# Altium project Distance-Sensor-Board.PrjPcb
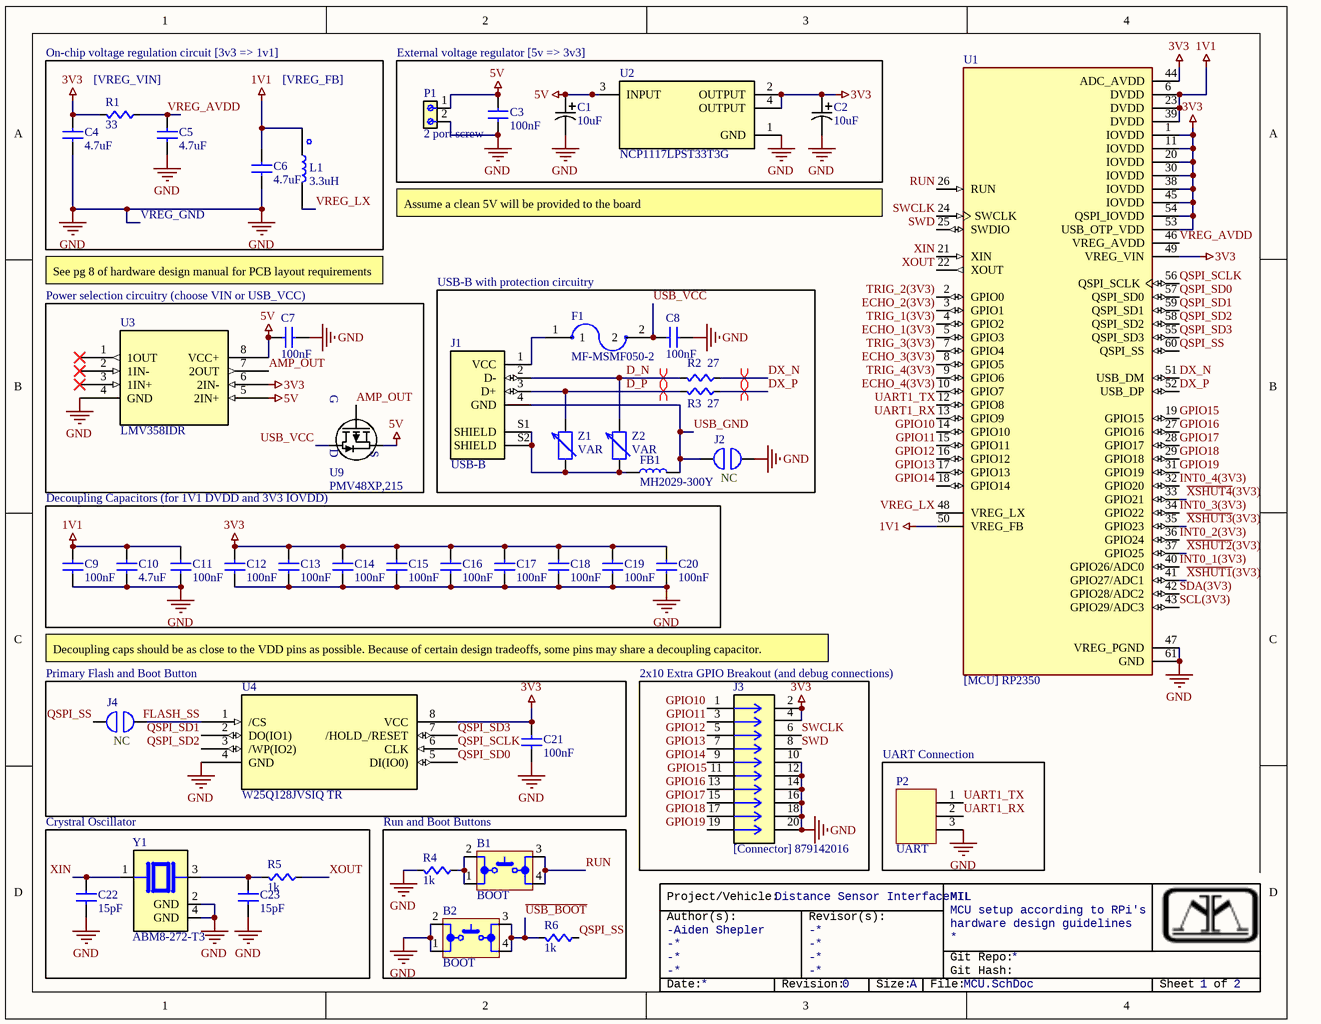
[diagram p0: MCU.SchDoc]
1 sheet, 48 parts. Net scope: global (net labels, ports and power ports of the same name join across sheets).
Board file: main.PcbDoc

## Sheet MCU.SchDoc
size A; Organization: MIL; Address1: MCU setup according to RPi's; Address2: hardware design guidelines; Revision: 0; SheetNumber: 1; SheetTotal: 2; Project: Distance Sensor Interface; Author1: Aiden Shepler

### Parts
B1  BOOT  [SPST-PUSH-BUTTON]
B2  BOOT  [SPST-PUSH-BUTTON]
C1  10uF  [RADIAL_CAN_CAP_4_X_5.8_SMD]
C2  10uF  [RADIAL_CAN_CAP_4_X_5.8_SMD]
C3  value 100nF  [CAPC0603]  (hidden comment: Cap)
C4  value 4.7uF  [CAPC0603]  (hidden comment: Cap)
C5  value 4.7uF  [CAPC0603]  (hidden comment: Cap)
C6  value 4.7uF  [CAPC0603]  (hidden comment: Cap)
C7  value 100nF  [CAPC0603]  (hidden comment: Cap)
C8  value 100nF  [CAPC0603]  (hidden comment: Cap)
C9  value 100nF  [CAPC0603]  (hidden comment: Cap)
C10  value 4.7uF  [CAPC0603]  (hidden comment: Cap)
C11  value 100nF  [CAPC0603]  (hidden comment: Cap)
C12  value 100nF  [CAPC0603]  (hidden comment: Cap)
C13  value 100nF  [CAPC0603]  (hidden comment: Cap)
C14  value 100nF  [CAPC0603]  (hidden comment: Cap)
C15  value 100nF  [CAPC0603]  (hidden comment: Cap)
C16  value 100nF  [CAPC0603]  (hidden comment: Cap)
C17  value 100nF  [CAPC0603]  (hidden comment: Cap)
C18  value 100nF  [CAPC0603]  (hidden comment: Cap)
C19  value 100nF  [CAPC0603]  (hidden comment: Cap)
C20  value 100nF  [CAPC0603]  (hidden comment: Cap)
C21  value 100nF  [CAPC0603]  (hidden comment: Cap)
C22  value 15pF  [CAPC0603]  (hidden comment: Cap)
C23  value 15pF  [CAPC0603]  (hidden comment: Cap)
F1  MF-MSMF050-2  [FUSM4632X85]
FB1  MH2029-300Y  [L0805]
J1  USB-B  [SAMTEC_USB-B-S-X-X-TH]
J2  NO/NC: NC  [[Jumper] Solderable Jumper]  (hidden comment: Thru-Hole Jumper)
J3  [Connector] 879142016  [[Connector] CONN20]
J4  NO/NC: NC  [[Jumper] Solderable Jumper]  (hidden comment: Thru-Hole Jumper)
L1  3.3uH  [2016_SMD_Inductor]
P1  2 port screw  [[CONNECTOR] 5MM_2PORT_SCREW]
P2  UART  [MOLEX-HDR-1X3-SHERLOCK-RA]
R1  value 33  [RES0603]  (hidden comment: Res)
R2  value 27  [RES0603]  (hidden comment: Res)
R3  value 27  [RES0603]  (hidden comment: Res)
R4  value 1k  [RES0603]  (hidden comment: Res)
R5  value 1k  [RES0603]  (hidden comment: Res)
R6  value 1k  [RES0603]  (hidden comment: Res)
U1  [MCU] RP2350  [QFN40P700X700X90-61N]
U2  NCP1117LPST33T3G  [SOT230P700X175-4N]
U3  LMV358IDR  [SOIC-8]
U4  W25Q128JVSIQ TR  [SOIC_208MIL_WIN]
U9  PMV48XP,215  [SOT23_NEX]
Y1  ABM8-272-T3  [XTAL_ABM8-272-T3]
Z1  VAR  [VARC1608X56N]
Z2  VAR  [VARC1608X56N]

### Blocks framed on the sheet
External voltage regulator [5v => 3v3]: C1-C3 P1 U2
USB-B with protection circuitry: C8 F1 FB1 J1 J2 R2 R3 Z1 Z2
Power selection circuitry (choose VIN or USB_VCC): C7 U3 U9
Decoupling Capacitors (for 1V1 DVDD and 3V3 IOVDD): C9-C20
Primary Flash and Boot Button: C21 J4 U4
2x10 Extra GPIO Breakout (and debug connections): J3
UART Connection: P2
Crystral Oscillator: C22 C23 R5 Y1
Run and Boot Buttons: B1 B2 R4 R6

### Nets
1V1: C6.1(A) C9.1(A) C10.1(A) C11.1(A) L1.1 U1.6(DVDD) U1.23(DVDD) U1.39(DVDD) U1.50(VREG_FB)
3V3: C2.1 C4.1(A) C12.1(A) C13.1(A) C14.1(A) C15.1(A) C16.1(A) C17.1(A) C18.1(A) C19.1(A) C20.1(A) C21.1(A) J3.2 J3.4 R1.1(A) U1.1(IOVDD) U1.11(IOVDD) U1.20(IOVDD) U1.30(IOVDD) U1.38(IOVDD) U1.44(ADC_AVDD) U1.45(IOVDD) U1.49(VREG_VIN) U1.53(USB_OTP_VDD) U1.54(QSPI_IOVDD) U2.2(OUTPUT) U2.4(OUTPUT) U3.6(2IN-) U4.8(VCC)
5V: C1.1 C3.1(A) C7.1(A) P1.1 U2.3(INPUT) U3.5(2IN+) U3.8(VCC+) U9.2(S)
GND: B2.1 B2.2 C1.2 C2.2 C3.2(B) C4.2(B) C5.2(B) C6.2(B) C7.2(B) C8.1(A) C9.2(B) C10.2(B) C11.2(B) C12.2(B) C13.2(B) C14.2(B) C15.2(B) C16.2(B) C17.2(B) C18.2(B) C19.2(B) C20.2(B) C21.2(B) C22.2(B) C23.2(B) J2.2 J3.10 J3.12 J3.14 J3.16 J3.18 J3.20 P1.2 P2.3 R4.1(A) U1.47(VREG_PGND) U1.61(GND) U2.1(GND) U3.4(GND) U4.4(GND) Y1.2(GND) Y1.4(GND)
AMP_OUT: U3.7(2OUT) U9.1(G)
D_N: J1.2(D-) R2.1(A) Z2.2
D_P: J1.3(D+) R3.1(A) Z1.2
DX_N: R2.2(B) U1.51(USB_DM)
DX_P: R3.2(B) U1.52(USB_DP)
ECHO_1(3V3): U1.5(GPIO3)
ECHO_2(3V3): U1.3(GPIO1)
ECHO_3(3V3): U1.8(GPIO5)
ECHO_4(3V3): U1.10(GPIO7)
FLASH_SS: J4.2 U4.1(/CS)
GPIO10: J3.1 U1.14(GPIO10)
GPIO11: J3.3 U1.15(GPIO11)
GPIO12: J3.5 U1.16(GPIO12)
GPIO13: J3.7 U1.17(GPIO13)
GPIO14: J3.9 U1.18(GPIO14)
GPIO15: J3.11 U1.19(GPIO15)
GPIO16: J3.13 U1.27(GPIO16)
GPIO17: J3.15 U1.28(GPIO17)
GPIO18: J3.17 U1.29(GPIO18)
GPIO19: J3.19 U1.31(GPIO19)
INT0_1(3V3): U1.40(GPIO26/ADC0)
INT0_2(3V3): U1.36(GPIO24)
INT0_3(3V3): U1.34(GPIO22)
INT0_4(3V3): U1.32(GPIO20)
QSPI_SCLK: U1.56(QSPI_SCLK) U4.6(CLK)
QSPI_SD0: U1.57(QSPI_SD0) U4.5(DI(IO0))
QSPI_SD1: U1.59(QSPI_SD1) U4.2(DO(IO1))
QSPI_SD2: U1.58(QSPI_SD2) U4.3(/WP(IO2))
QSPI_SD3: U1.55(QSPI_SD3) U4.7(/HOLD_/RESET)
QSPI_SS: J4.1 R6.2(B) U1.60(QSPI_SS)
RUN: B1.3 B1.4 U1.26(RUN)
SCL(3V3): U1.43(GPIO29/ADC3)
SDA(3V3): U1.42(GPIO28/ADC2)
SWCLK: J3.6 U1.24(SWCLK)
SWD: J3.8 U1.25(SWDIO)
TRIG_1(3V3): U1.4(GPIO2)
TRIG_2(3V3): U1.2(GPIO0)
TRIG_3(3V3): U1.7(GPIO4)
TRIG_4(3V3): U1.9(GPIO6)
~{USB_BOOT}: B2.3 B2.4 R6.1(A)
UART1_RX: P2.2 U1.13(GPIO9)
UART1_TX: P2.1 U1.12(GPIO8)
USB_GND: FB1.2 J1.4(GND) J2.1
USB_VCC: C8.2(B) F1.2 U9.3(D)
VREG_AVDD: C5.1(A) R1.2(B) U1.46(VREG_AVDD)
VREG_LX: L1.2 U1.48(VREG_LX)
~{XSHUT1}(3V3): U1.41(GPIO27/ADC1)
~{XSHUT2}(3V3): U1.37(GPIO25)
~{XSHUT3}(3V3): U1.35(GPIO23)
~{XSHUT4}(3V3): U1.33(GPIO21)
XIN: C22.1(A) U1.21(XIN) Y1.1
XOUT: R5.2(B) U1.22(XOUT)
NetB1_1: B1.1 B1.2 R4.2(B)
NetC23_1: C23.1(A) R5.1(A) Y1.3
NetF1_1: F1.1 J1.1(VCC)
NetFB1_1: FB1.1 J1.S1(SHIELD) J1.S2(SHIELD) Z1.1 Z2.1

Not connected (* = marked no-connect by the designer): U3 1(1OUT)* 2(1IN-)* 3(1IN+)*

### Layout directives
differential pair: D_N, D_P, DX_N, DX_P

### Notes on the sheet
- On-chip voltage regulation circuit [3v3 => 1v1]
- [VREG_VIN]
- [VREG_FB]
- VREG_GND
- Assume a clean 5V will be provided to the board
- See pg 8 of hardware design manual for PCB layout requirements
- Decoupling caps should be as close to the VDD pins as possible. Because of certain design tradeoffs, some pins may share a decoupling capacitor.
- Project/Vehicle:
- Author(s):
- -
- Revisor(s):
- Git Repo:
- Git Hash:
- Date:
- Revision:
- Size:
- A
- File:
- Sheet
- of

### Library data of the parts
B1 B2 = 1825910-6: SWITCH TACTILE SPST-NO 0.05A 24V; Manufacturer: TE Connectivity Alcoswitch; Actuator Material: PBT; Mechanical Life: 100000Cycles; Operating Force: 160gf; Throw Configuration: SPST; Illumination Type: Non-Illuminated,Illuminated; Switch Travel: 0.25mm; Switch Function: Off-Mom; Contact Current Rating: 50mA; Actuator Type: Standard; Contact Resistance: 100mR; Actuator Length: 0.055inch; Manufacturer Part Number: 1825910-6; RoHS: Yes; Category: Pushbutton Switches; Stock 1: 97530; Pricing 1: 1=0,10000, 10=0,10100, 25=0,09560, 100=0,08700, 250=0,08180, 500=0,07484, 1000=0,06265, 2500=0,06092, 5000=0,05743 (USD); Mount: Through Hole; Contact Material: Copper Alloy; Contact Plating: Silver; Min Operating Temperature: -35°C; Max Operating Temperature: 85°C; Termination: PC Pins; Package Quantity: 750; Packaging: Loose Piece; Orientation: Straight; Max Voltage Rating (DC): 24V; Electrical Life: 100000Cycles; Max Current Rating: 50mA; Type: Switch; Length: 5.99mm; REACH SVHC: Unknown; ELV: Compliant; Lead Free: Lead Free; ComponentLink1URL: https://datasheet.ciiva.com/30199/1825910-6rqpn1825910-6-30199520.pdf?src-supplier=Onlinecomponents.com; ComponentLink1Description: https://datasheet.ciiva.com/30199/1825910-6rqpn1825910-6-30199520.pdf?src-supplier=Onlinecomponents.com; ComponentLink2URL: https://datasheet.ciiva.com/15184/getdatasheetpartid-395915-15184509.pdf?src-supplier=Verical; ComponentLink2Description: https://datasheet.ciiva.com/15184/getdatasheetpartid-395915-15184509.pdf?src-supplier=Verical; Supplier 1: Digi-Key; Supplier Part Number 1: 450-1650-ND
C1 C2 = EEE-FK1E100R: 10uF electrolytic cap, radial can, SMD; Manufacturer_Name: Panasonic; Copyright: Copyright (C) 2025 Ultra Librarian. All rights reserved.; Manufacturer_Part_Number: EEE-FK1E100R
F1 = MF-MSMF050-2: [Fuse] Polymeric PTC Resettable Fuse 15V 500 mA Ih Surface Mount 1812 (4532 Metric), Concave; MF: Bourns; MP: MF-MSMF050-2; Availability: In Stock; Check_prices: https://www.snapeda.com/parts/MF-MSMF050-2/Bourns+-+J.W.+Miller/view-part/?ref=eda; Price: None; Package: 1812 Bourns; Purchase-URL: https://pricing.snapeda.com/search/part/MF-MSMF050-2/?ref=eda; Value: *; SnapEDA_Link: https://www.snapeda.com/parts/MF-MSMF050-2/Bourns+-+J.W.+Miller/view-part/?ref=snap
FB1 = MH2029-300Y: [Inductor] Ferrite Bead Bourns MH2029-300Y / SMD-FERRITE-BEAD-30R-3A(0805); SnapEDA_Link: https://www.snapeda.com/parts/MH2029-300Y/Bourns/view-part/?ref=snap; Package: 0805 Bourns; Value: *; MF: Bourns; MP: MH2029-300Y; Check_prices: https://www.snapeda.com/parts/MH2029-300Y/Bourns/view-part/?ref=eda
J1 = USB-B-S-X-X-TH: USB-B (USB TYPE-B) USB 2.0 Receptacle Connector 4 Position Through Hole, Right Angle; MF: Samtec; MP: USB-B-S-F-W-TH-TR; SnapEDA_Link: https://www.snapeda.com/parts/USB-B-S-F-W-TH-TR/Samtec/view-part/?ref=snap; Package: None; Value: *; Check_prices: https://www.snapeda.com/parts/USB-B-S-F-W-TH-TR/Samtec/view-part/?ref=eda
J2 J4 = [Jump] Thru-Hole 2pin: Clip Jumper
J3 = [Connector] 879142016: 2x10 2.54mm pitch header; Package: None; Price: None; Value: *; MP: 879142016; Availability: Unavailable
L1 = INDUCTOR 3.3uH: Power Inductors - SMD IND 3.3uH used for RP2350 VREG; Manufacturer_Name: ABRACON; Manufacturer_Part_Number: AOTA-B201610S3R3-101-T; Geometry.Height: 1mm; Mouser Part Number: 815-AB201610S3R3101T; Mouser Price/Stock: https://www.mouser.co.uk/ProductDetail/ABRACON/AOTA-B201610S3R3-101-T?qs=%252BXxaIXUDbq0IZvJW%2F2mv4w%3D%3D; Datasheet Link: https://abracon.com/datasheets/AOTA-B201610S3R3-101-T.pdf
P1 = [Connector] 691213510002: 2 Position Wire to Board Terminal Block Horizontal with Board 0.200 (5.08mm) Through Hole; MF: WÃ¼rth Elektronik; SnapEDA_Link: https://www.snapeda.com/parts/691213510002/W%25C3%25BCrth+Elektronik+Midcom/view-part/?ref=snap; Package: None; Value: *; MP: 691213510002; Check_prices: https://www.snapeda.com/parts/691213510002/W%25C3%25BCrth+Elektronik+Midcom/view-part/?ref=eda
P2 = MOLEX-HDR-1x3-SHERLOCK_RA: Header, Molex, 2mm Pitch Sherlock Header, Single Row, Right Angle 3 Circuits, Length 3.3mm; Manufacturer Part Number: 35363-0360; Manufacturer: Molex Connector Corporation; Supplier Part Number 1: WM18932-ND; Supplier 1: Digi-Key
R1-R6 = Res: SMD, RES0603; Supplier 1: Digi-Key; Supplier Part Number 1: RMCF0603JT10K0CT-ND
U1 = SC1509(13): RP2350A MCU from Raspberry Pi Pico; QFN 60 7x7,; MP: SC1509-A4; SnapEDA_Link: https://www.snapeda.com/parts/SC1509-A4/Raspberry+Pi/view-part/?ref=snap; Package: None; Value: *; MF: Raspberry Pi; Check_prices: https://www.snapeda.com/parts/SC1509-A4/Raspberry+Pi/view-part/?ref=eda
U2 = NCP1117LPST33T3G: Linear Voltage Regulator IC Positive Fixed 1 Output 1A SOT-223; MF: ON Semiconductor; SnapEDA_Link: https://www.snapeda.com/parts/NCP1117LPST33T3G/Onsemi/view-part/?ref=snap; Package: SOT-223-4 ON Semiconductor; Value: *; MP: NCP1117LPST33T3G; Check_prices: https://www.snapeda.com/parts/NCP1117LPST33T3G/Onsemi/view-part/?ref=eda
U3 = LMV358IDR: [Op-Amp] Dual, 5.5-V, 1-MHz, RRO operational amplifier 8-SOIC -40 to 125; Manufacturer_Name: Texas Instruments; Copyright: Copyright (C) 2025 Ultra Librarian. All rights reserved.; Manufacturer_Part_Number: LMV358IDR; Datasheet: https://www.ti.com/lit/gpn/lmv358; RefDes: RefDes; Type: Type
U4 = W25Q128JVSIQ TR: IC FLASH 128MBIT SPI/QUAD 8SOIC; Manufacturer_Name: Winbond; Copyright: Copyright (C) 2025 Ultra Librarian. All rights reserved.; Manufacturer_Part_Number: W25Q128JVSIQ TR; RefDes: RefDes; Type: Type
U9 = [PMOS] PMV48XP,215: MOSFET P-CH 20V 3.5A TO236AB; Manufacturer_Name: Nexperia; Copyright: Copyright (C) 2025 Ultra Librarian. All rights reserved.; Manufacturer_Part_Number: PMV48XP,215
Y1 = ABM8-272-T3: 12 MHz Â±30ppm Crystal 10pF 50 Ohms 4-SMD, No Lead; MF: ABRACON; SnapEDA_Link: https://www.snapeda.com/parts/ABM8-272-T3/Abracon/view-part/?ref=snap; Package: NON-STANDARD-4 Abracon; Value: *; MP: ABM8-272-T3; Check_prices: https://www.snapeda.com/parts/ABM8-272-T3/Abracon/view-part/?ref=eda
Z1 Z2 = CG0603MLC-05E: [Varistor] 1 Circuit Surface Mount, MLCV 0603 (1608 Metric); MF: Bourns; Package: 0603 Bourns Inc.; Availability: In Stock; Value: *; MP: CG0603MLC-05E; Purchase-URL: https://pricing.snapeda.com/search/part/CG0603MLC-05E/?ref=eda; Check_prices: https://www.snapeda.com/parts/CG0603MLC-05E/Bourns+-+J.W.+Miller/view-part/?ref=eda; Price: None; SnapEDA_Link: https://www.snapeda.com/parts/CG0603MLC-05E/Bourns+-+J.W.+Miller/view-part/?ref=snap
C3-C23 = Cap: Supplier 1: Digi-Key; Supplier Part Number 1: 1276-1000-1-ND